# Altium project Hobots-A-Coach-405.PrjPcb
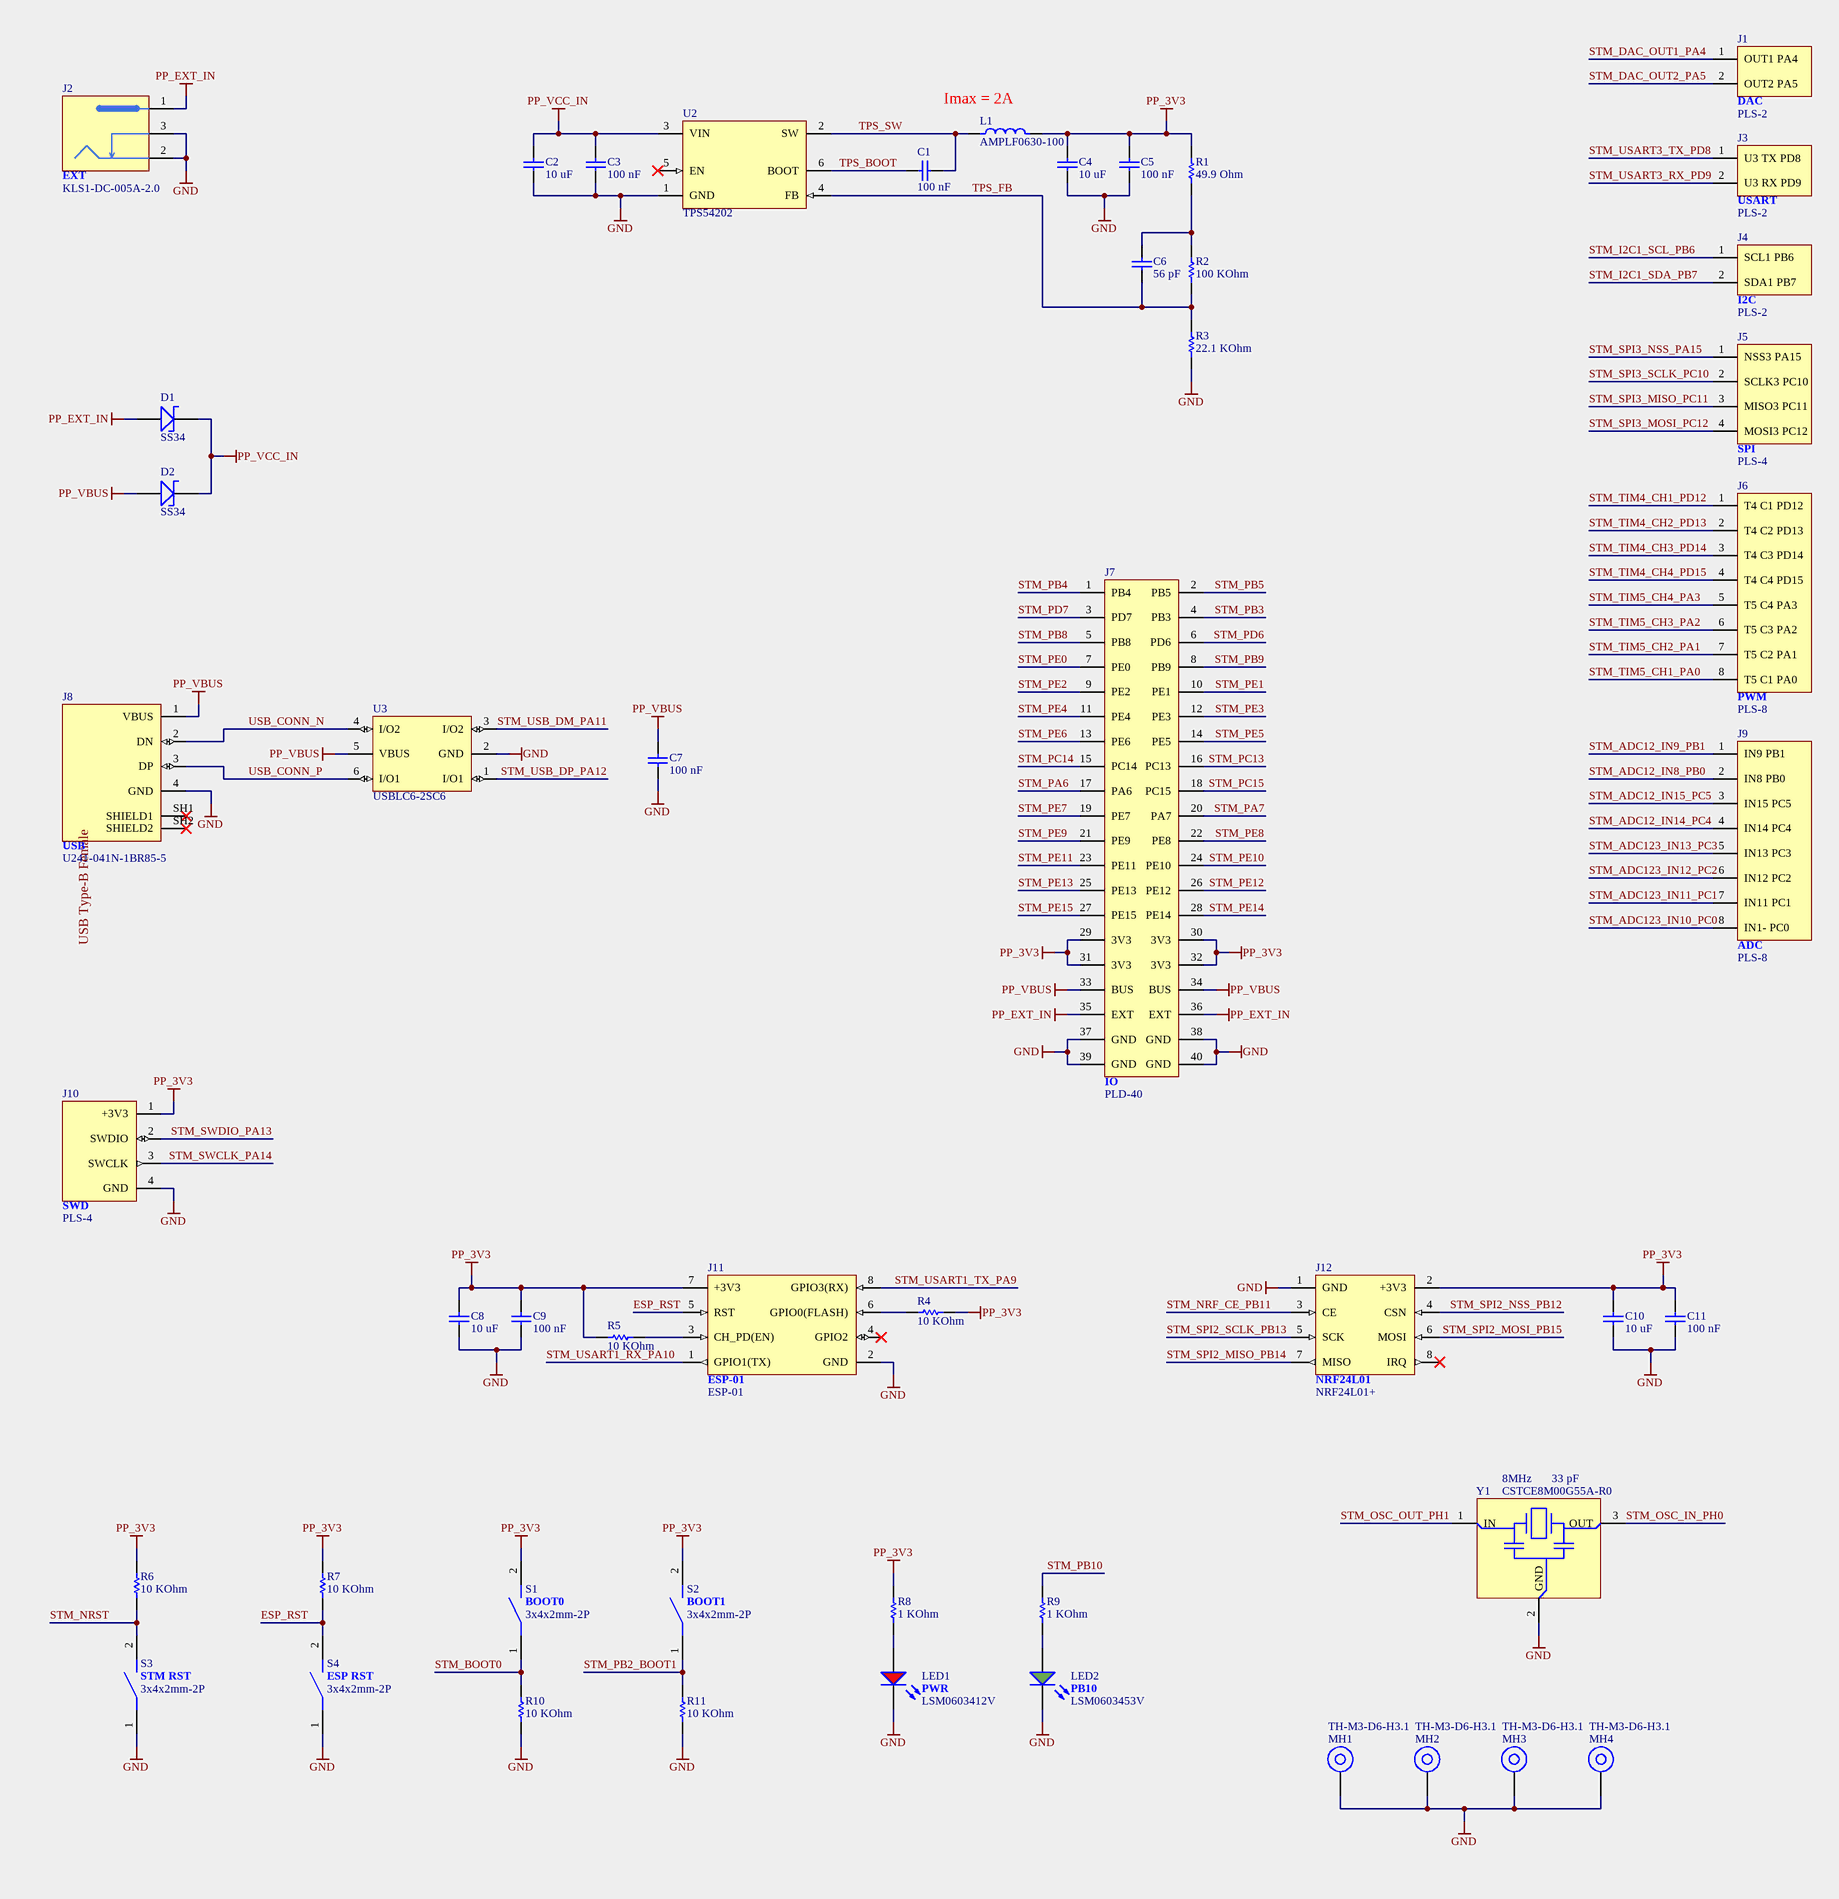
[diagram p0: Hobots-A-Coach-405.SchDoc, left]
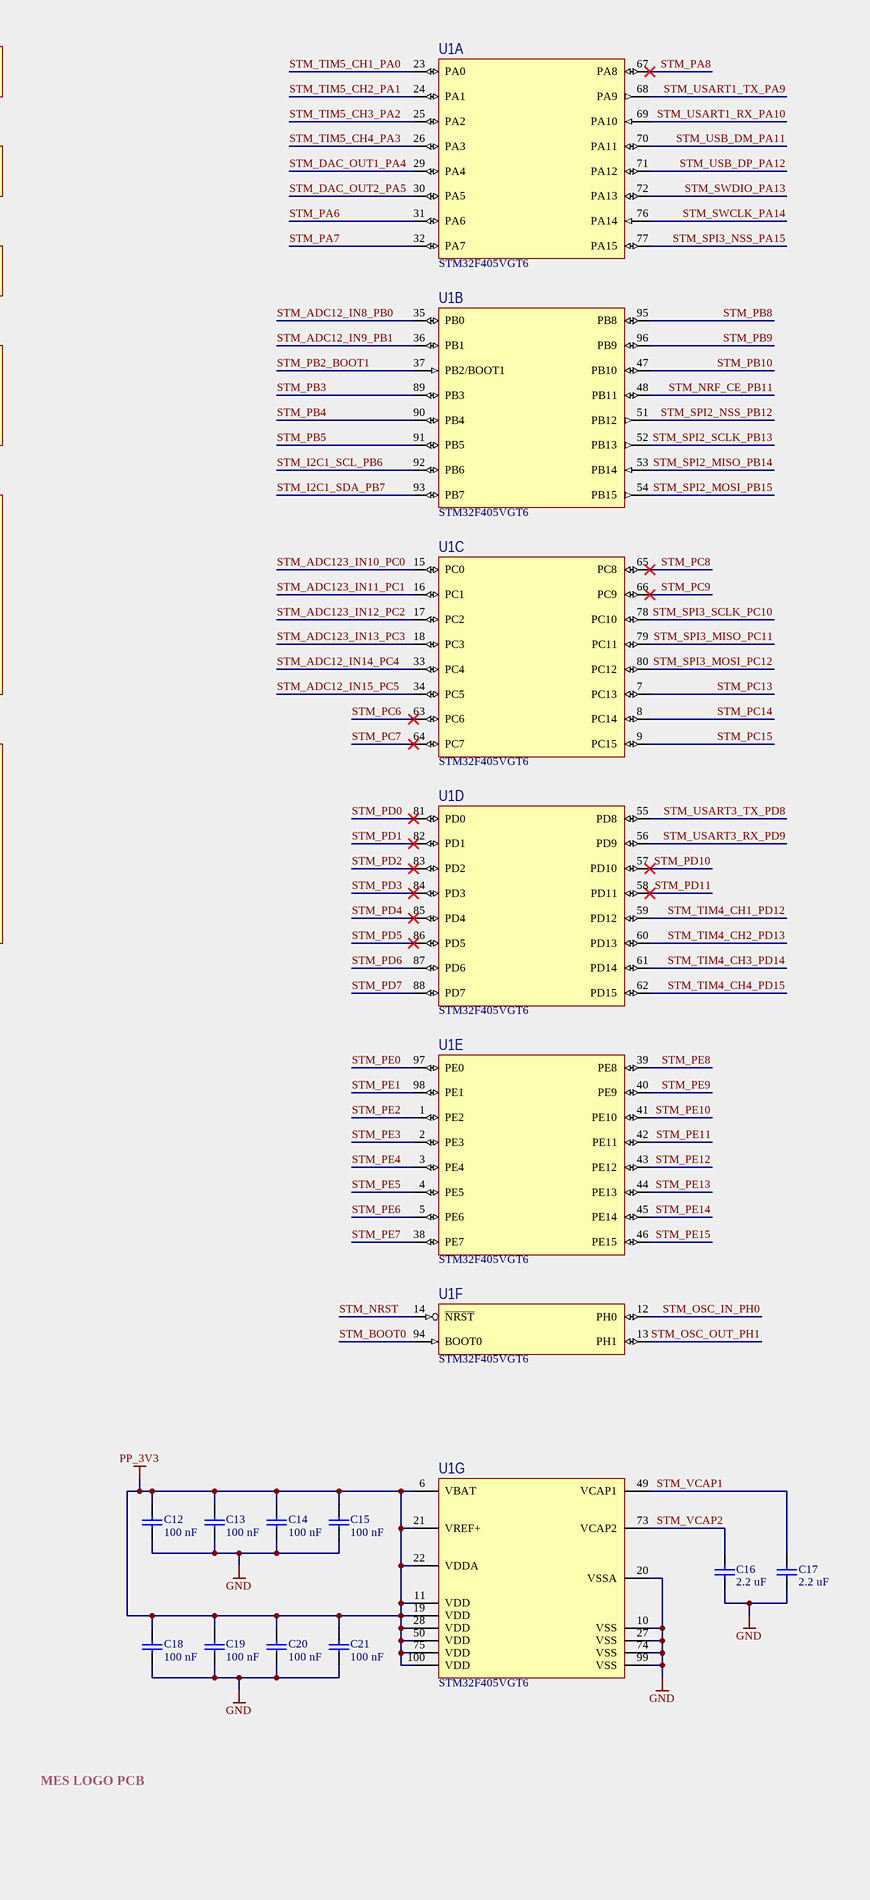
[diagram p1: Hobots-A-Coach-405.SchDoc, right]
1 sheet, 62 parts. Net scope: global (net labels, ports and power ports of the same name join across sheets).
Board file: Hobots-A-Coach-405.PcbDoc

## Sheet Hobots-A-Coach-405.SchDoc: Hobots-A-Coach F405VG
size A2; DrawnBy: School; Organization: MES; Address1: Modern; Address2: Engineering; DocumentNumber: 1; Revision: v1.0; SheetNumber: 1; SheetTotal: 1

### Parts
C1  Capacitance: 100 nF  [CAPC0603]  (hidden comment: CAP-100N)
C2  Capacitance: 10 uF  [CAPC0603]  (hidden comment: CAP-10U)
C3  Capacitance: 100 nF  [CAPC0603]  (hidden comment: CAP-100N)
C4  Capacitance: 10 uF  [CAPC0603]  (hidden comment: CAP-10U)
C5  Capacitance: 100 nF  [CAPC0603]  (hidden comment: CAP-100N)
C6  Capacitance: 56 pF  [CAPC0603]  (hidden comment: CAP-56P)
C7  Capacitance: 100 nF  [CAPC0603]  (hidden comment: CAP-100N)
C8  Capacitance: 10 uF  [CAPC0603]  (hidden comment: CAP-10U)
C9  Capacitance: 100 nF  [CAPC0603]  (hidden comment: CAP-100N)
C10  Capacitance: 10 uF  [CAPC0603]  (hidden comment: CAP-10U)
C11  Capacitance: 100 nF  [CAPC0603]  (hidden comment: CAP-100N)
C12  Capacitance: 100 nF  [CAPC0603]  (hidden comment: CAP-100N)
C13  Capacitance: 100 nF  [CAPC0603]  (hidden comment: CAP-100N)
C14  Capacitance: 100 nF  [CAPC0603]  (hidden comment: CAP-100N)
C15  Capacitance: 100 nF  [CAPC0603]  (hidden comment: CAP-100N)
C16  Capacitance: 2.2 uF  [CAPC0603]  (hidden comment: CAP-2U2)
C17  Capacitance: 2.2 uF  [CAPC0603]  (hidden comment: CAP-2U2)
C18  Capacitance: 100 nF  [CAPC0603]  (hidden comment: CAP-100N)
C19  Capacitance: 100 nF  [CAPC0603]  (hidden comment: CAP-100N)
C20  Capacitance: 100 nF  [CAPC0603]  (hidden comment: CAP-100N)
C21  Capacitance: 100 nF  [CAPC0603]  (hidden comment: CAP-100N)
D1  SS34  [DO-214AC(SMA)]
D2  SS34  [DO-214AC(SMA)]
G1  MES Logo  [MES_LOGO_COPPER_3MM]  (value not drawn)  (no BOM)
J1  DAC  [PLS-2]
J2  EXT  [KLS1-DC-005]
J3  USART  [PLS-2]
J4  I2C  [PLS-2]
J5  SPI  [PLS-4]
J6  PWM  [PLS-8]
J7  IO  [PLD-40]
J8  USB  [U241-041N-1BR85-5]
J9  ADC  [PLS-8]
J10  SWD  [PLS-4]
J11  ESP-01  [ESP-01 Socket]
J12  NRF24L01  PartNumber: NRF24L01+  [NRF24L01+ Socket]
L1  AMPLF0630-100  [AMPLF0630]
LED1  PWR  [LSM0603-Series]
LED2  PB10  [LSM0603-Series]
MH1  TH-M3-D6-H3.1  [TH-M3-D6-H3.1]  (no BOM)
MH2  TH-M3-D6-H3.1  [TH-M3-D6-H3.1]  (no BOM)
MH3  TH-M3-D6-H3.1  [TH-M3-D6-H3.1]  (no BOM)
MH4  TH-M3-D6-H3.1  [TH-M3-D6-H3.1]  (no BOM)
R1  Resistance: 49.9 Ohm  [RES0603]  (hidden comment: RES-49R9)
R2  Resistance: 100 KOhm  [RES0603]  (hidden comment: RES-100K)
R3  Resistance: 22.1 KOhm  [RES0603]  (hidden comment: RES-22K1)
R4  Resistance: 10 KOhm  [RES0603]  (hidden comment: RES-10K)
R5  Resistance: 10 KOhm  [RES0603]  (hidden comment: RES-10K)
R6  Resistance: 10 KOhm  [RES0603]  (hidden comment: RES-10K)
R7  Resistance: 10 KOhm  [RES0603]  (hidden comment: RES-10K)
R8  Resistance: 1 KOhm  [RES0603]  (hidden comment: RES-1K)
R9  Resistance: 1 KOhm  [RES0603]  (hidden comment: RES-1K)
R10  Resistance: 10 KOhm  [RES0603]  (hidden comment: RES-10K)
R11  Resistance: 10 KOhm  [RES0603]  (hidden comment: RES-10K)
S1  BOOT0  Model: 3x4x2mm-2P  [Tactile Switch SMD 3x4x2-2p]
S2  BOOT1  Model: 3x4x2mm-2P  [Tactile Switch SMD 3x4x2-2p]
S3  STM RST  Model: 3x4x2mm-2P  [Tactile Switch SMD 3x4x2-2p]
S4  ESP RST  Model: 3x4x2mm-2P  [Tactile Switch SMD 3x4x2-2p]
U1  STM32F405VGT6  [LQFP-100-STM32]  (parts A,B,C,D,E,F,G of 7)
U2  TPS54202  [SOT23-6-TI-TPS54202]
U3  USBLC6-2SC6  [SOT23-6L-STM]
Y1  LoadCapacitance: 33 pF  Frequency: 8MHz  [MURATA_3213]  (hidden comment: CSTCE8M00G55A-R0)

### Nets
GND: C2.1 C3.1 C4.1 C5.1 C7.1 C8.1 C9.1 C10.1 C11.1 C12.1 C13.1 C14.1 C15.1 C16.1 C17.1 C18.1 C19.1 C20.1 C21.1 J2.2(%) J2.3(%) J7.37(GND) J7.38(GND) J7.39(GND) J7.40(GND) J8.4(GND) J10.4(GND) J11.2(GND) J12.1(GND) LED1.1(K) LED2.1(K) MH1.PTH MH2.PTH MH3.PTH MH4.PTH R3.1 R10.1 R11.1 S3.1 S4.1 U1.10(VSS) U1.20(VSSA) U1.27(VSS) U1.74(VSS) U1.99(VSS) U2.1(GND) U3.2(GND) Y1.2(GND)
PP_3V3: C4.2 C5.2 C8.2 C9.2 C10.2 C11.2 C12.2 C13.2 C14.2 C15.2 C18.2 C19.2 C20.2 C21.2 J7.29(3V3) J7.30(3V3) J7.31(3V3) J7.32(3V3) J10.1(+3V3) J11.7(+3V3) J12.2(+3V3) L1.1 R1.2 R4.1 R5.2 R6.2 R7.2 R8.2 S1.2 S2.2 U1.6(VBAT) U1.11(VDD) U1.19(VDD) U1.21(VREF+) U1.22(VDDA) U1.28(VDD) U1.50(VDD) U1.75(VDD) U1.100(VDD)
PP_EXT_IN: D1.2(A) J2.1(%) J7.35(EXT) J7.36(EXT)
PP_VBUS: C7.2 D2.2(A) J7.33(BUS) J7.34(BUS) J8.1(VBUS) U3.5(VBUS)
PP_VCC_IN: C2.2 C3.2 D1.1(C) D2.1(C) U2.3(VIN)
ESP_RST: J11.5(RST) R7.1 S4.2
STM_ADC12_IN8_PB0: J9.2(IN8_PB0) U1.35(PB0)
STM_ADC12_IN9_PB1: J9.1(IN9_PB1) U1.36(PB1)
STM_ADC12_IN14_PC4: J9.4(IN14_PC4) U1.33(PC4)
STM_ADC12_IN15_PC5: J9.3(IN15_PC5) U1.34(PC5)
STM_ADC123_IN10_PC0: J9.8(IN1-_PC0) U1.15(PC0)
STM_ADC123_IN11_PC1: J9.7(IN11_PC1) U1.16(PC1)
STM_ADC123_IN12_PC2: J9.6(IN12_PC2) U1.17(PC2)
STM_ADC123_IN13_PC3: J9.5(IN13_PC3) U1.18(PC3)
STM_BOOT0: R10.2 S1.1 U1.94(BOOT0)
STM_DAC_OUT1_PA4: J1.1(OUT1_PA4) U1.29(PA4)
STM_DAC_OUT2_PA5: J1.2(OUT2_PA5) U1.30(PA5)
STM_I2C1_SCL_PB6: J4.1(SCL1_PB6) U1.92(PB6)
STM_I2C1_SDA_PB7: J4.2(SDA1_PB7) U1.93(PB7)
STM_NRF_CE_PB11: J12.3(CE) U1.48(PB11)
STM_NRST: R6.1 S3.2 U1.14(~{NRST})
STM_OSC_IN_PH0: U1.12(PH0) Y1.3(OUT)
STM_OSC_OUT_PH1: U1.13(PH1) Y1.1(IN)
STM_PA6: J7.17(PA6) U1.31(PA6)
STM_PA7: J7.20(PA7) U1.32(PA7)
STM_PA8: U1.67(PA8)
STM_PB2_BOOT1: R11.2 S2.1 U1.37(PB2/BOOT1)
STM_PB3: J7.4(PB3) U1.89(PB3)
STM_PB4: J7.1(PB4) U1.90(PB4)
STM_PB5: J7.2(PB5) U1.91(PB5)
STM_PB8: J7.5(PB8) U1.95(PB8)
STM_PB9: J7.8(PB9) U1.96(PB9)
STM_PB10: R9.2 U1.47(PB10)
STM_PC6: U1.63(PC6)
STM_PC7: U1.64(PC7)
STM_PC8: U1.65(PC8)
STM_PC9: U1.66(PC9)
STM_PC13: J7.16(PC13) U1.7(PC13)
STM_PC14: J7.15(PC14) U1.8(PC14)
STM_PC15: J7.18(PC15) U1.9(PC15)
STM_PD0: U1.81(PD0)
STM_PD1: U1.82(PD1)
STM_PD2: U1.83(PD2)
STM_PD3: U1.84(PD3)
STM_PD4: U1.85(PD4)
STM_PD5: U1.86(PD5)
STM_PD6: J7.6(PD6) U1.87(PD6)
STM_PD7: J7.3(PD7) U1.88(PD7)
STM_PD10: U1.57(PD10)
STM_PD11: U1.58(PD11)
STM_PE0: J7.7(PE0) U1.97(PE0)
STM_PE1: J7.10(PE1) U1.98(PE1)
STM_PE2: J7.9(PE2) U1.1(PE2)
STM_PE3: J7.12(PE3) U1.2(PE3)
STM_PE4: J7.11(PE4) U1.3(PE4)
STM_PE5: J7.14(PE5) U1.4(PE5)
STM_PE6: J7.13(PE6) U1.5(PE6)
STM_PE7: J7.19(PE7) U1.38(PE7)
STM_PE8: J7.22(PE8) U1.39(PE8)
STM_PE9: J7.21(PE9) U1.40(PE9)
STM_PE10: J7.24(PE10) U1.41(PE10)
STM_PE11: J7.23(PE11) U1.42(PE11)
STM_PE12: J7.26(PE12) U1.43(PE12)
STM_PE13: J7.25(PE13) U1.44(PE13)
STM_PE14: J7.28(PE14) U1.45(PE14)
STM_PE15: J7.27(PE15) U1.46(PE15)
STM_SPI2_MISO_PB14: J12.7(MISO) U1.53(PB14)
STM_SPI2_MOSI_PB15: J12.6(MOSI) U1.54(PB15)
STM_SPI2_NSS_PB12: J12.4(CSN) U1.51(PB12)
STM_SPI2_SCLK_PB13: J12.5(SCK) U1.52(PB13)
STM_SPI3_MISO_PC11: J5.3(MISO3_PC11) U1.79(PC11)
STM_SPI3_MOSI_PC12: J5.4(MOSI3_PC12) U1.80(PC12)
STM_SPI3_NSS_PA15: J5.1(NSS3_PA15) U1.77(PA15)
STM_SPI3_SCLK_PC10: J5.2(SCLK3_PC10) U1.78(PC10)
STM_SWCLK_PA14: J10.3(SWCLK) U1.76(PA14)
STM_SWDIO_PA13: J10.2(SWDIO) U1.72(PA13)
STM_TIM4_CH1_PD12: J6.1(T4_C1_PD12) U1.59(PD12)
STM_TIM4_CH2_PD13: J6.2(T4_C2_PD13) U1.60(PD13)
STM_TIM4_CH3_PD14: J6.3(T4_C3_PD14) U1.61(PD14)
STM_TIM4_CH4_PD15: J6.4(T4_C4_PD15) U1.62(PD15)
STM_TIM5_CH1_PA0: J6.8(T5_C1_PA0) U1.23(PA0)
STM_TIM5_CH2_PA1: J6.7(T5_C2_PA1) U1.24(PA1)
STM_TIM5_CH3_PA2: J6.6(T5_C3_PA2) U1.25(PA2)
STM_TIM5_CH4_PA3: J6.5(T5_C4_PA3) U1.26(PA3)
STM_USART1_RX_PA10: J11.1(GPIO1(TX)) U1.69(PA10)
STM_USART1_TX_PA9: J11.8(GPIO3(RX)) U1.68(PA9)
STM_USART3_RX_PD9: J3.2(U3_RX_PD9) U1.56(PD9)
STM_USART3_TX_PD8: J3.1(U3_TX_PD8) U1.55(PD8)
STM_USB_DM_PA11: U1.70(PA11) U3.3(I/O2)
STM_USB_DP_PA12: U1.71(PA12) U3.1(I/O1)
STM_VCAP1: C17.2 U1.49(VCAP1)
STM_VCAP2: C16.2 U1.73(VCAP2)
TPS_BOOT: C1.2 U2.6(BOOT)
TPS_FB: C6.1 R2.1 R3.2 U2.4(FB)
TPS_SW: C1.1 L1.2 U2.2(SW)
USB_CONN_N: J8.2(DN) U3.4(I/O2)
USB_CONN_P: J8.3(DP) U3.6(I/O1)
NetC6_2: C6.2 R1.1 R2.2
NetJ11_3: J11.3(CH_PD(EN)) R5.1
NetJ11_6: J11.6(GPIO0(FLASH)) R4.2
NetLED1_2: LED1.2(A) R8.1
NetLED2_2: LED2.2(A) R9.1

Not connected (* = marked no-connect by the designer): J8 SH1(SHIELD1)* SH2(SHIELD2)*; J11 4(GPIO2)*; J12 8(IRQ)*; U2 5(EN)*

### Notes on the sheet
- (near L1) Imax = 2A
- Title
- Size:
- Date:
- File:
- A2
- Number:
- Time:
- Revision:
- Sheet
- of
- (in symbol MES Logo) MES LOGO PCB
- (in symbol USB-B U241-041N-1BR85-5) USB Type-B Female

### Library data of the parts
C1 C3 C5 C7 C9 C11-C15 C18-C21 = CAP-100N: Chip Capacitor, 100 nF, +/- 5%; Voltage Rating: 50 V; Mount: Surface Mount; Tolerance: 5 %; Type: Capacitor
C2 C4 C8 C10 = CAP-10U: Chip Capacitor, 10 uF, +/- 5%; Voltage Rating: 50 V; Mount: Surface Mount; Tolerance: 5 %; Type: Capacitor
C6 = CAP-56P: Chip Capacitor, 56 pF, +/- 5%; Voltage Rating: 50 V; Mount: Surface Mount; Tolerance: 5 %; Type: Capacitor
C16 C17 = CAP-2U2: Chip Capacitor, 2.2 uF, +/- 5; Voltage Rating: 50 V; Tolerance: 5 %; Mount: Surface Mount; Type: Capacitor
D1 D2 = SS34: 40V 3A Low forward voltage drop. High current capability Schottky Diode.; Type: Schottky Diode; Mount: Surface Mount; PartNumber: SS34
G1 = MES Logo: Logotips MES GROUP
J1 J3 J4 = PLS-2: pitch 2.54; Type: Connector; Mount: Through Hole; PartNumber: PLS-2
J2 = KLS1-DC-005A-2.0: 5.5mm 2.0mm 2A 16V; Type: Connector; Mount: Through Hole; PartNumber: KLS1-DC-005A-2.0
J5 = PLS-4: pitch 2.54; Type: Connector; Mount: Through Hole; PartNumber: PLS-4
J6 J9 = PLS-8: pitch 2.54; Type: Connector; Mount: Through Hole; PartNumber: PLS-8
J7 = PLD-40: 2 row, pitch 2.54; Type: Connector; Mount: Through Hole; PartNumber: PLD-40
J8 = USB-B U241-041N-1BR85-5: USB - Type B Female USB 2 4 Through Hole USB Connectors; Type: Connector; Mount: Through Hole; PartNumber: U241-041N-1BR85-5
J10 = SWD-PLS4: STM SWD 4 pin; Type: Connector; Mount: Through Hole; PartNumber: PLS-4
J11 = ESP-01 Socket: Socket for ESP8266 ESP-01 Connector PBD 8 pins 2x4 pitch 2.54; Type: Connector; Mount: Through Hole; PartNumber: ESP-01
J12 = NRF24L01+ Socket: Socket for NRF24L01 / NRF24L01+ Connector PBD 8 pins 2x4 pitch 2.54; Type: Connector; Mount: Through Hole
L1 = AMPLF0630-100: Shielded Power Inductor 10μH ± 20%; DC Current: 3.6A; Type: Inductor; Mount: Surface Mount; PartNumber: AMPLF0630-100
LED1 = LSM0603412V: Red LED 0603 2V 20mA; Mount: Surface Mount; Type: LED; Color: Red; PartNumber: LSM0603412V
LED2 = LSM0603453V: Green LED 0603 3V 20mA; Mount: Surface Mount; Type: LED; Color: Green; PartNumber: LSM0603453V
R1 = RES-49R9: Chip Resistor, 49.9 Ohm, +/- 1%; Voltage Rating: 50 V; Mount: Surface Mount; Tolerance: 1 %; Type: Resistor
R2 = RES-100K: Chip Resistor, 100 KOhm, +/- 1%; Voltage Rating: 50 V; Mount: Surface Mount; Tolerance: 1 %; Type: Resistor
R3 = RES-22K1: Chip Resistor, 22.1 KOhm, +/- 1%; Voltage Rating: 50 V; Mount: Surface Mount; Tolerance: 1 %; Type: Resistor
R4-R7 R10 R11 = RES-10K: Chip Resistor, 10 KOhm, +/- 1%; Voltage Rating: 50 V; Mount: Surface Mount; Tolerance: 1 %; Type: Resistor
R8 R9 = RES-1K: Chip Resistor, 1 KOhm, +/- 1%; Voltage Rating: 50 V; Mount: Surface Mount; Tolerance: 1 %; Type: Resistor
S1-S4 = Tactile Switch 2P 3x4x2: 2-Pin SMD Tactile Switch, sunrom 3x4x2mm 12V DC 0.2A; Type: Tactile Switch; Mount: Surface Mount
U1 = STM32F405VGT6: 1024 KB Flash 192 RAM 168 MHz ARM based 32-bit MCU; Digit: 32 bit; Type: Microcontroller; Mount: Surface Mount; PartNumber: STM32F405VGT6
U2 = TPS54202: 4.5-V to 28-V Input, 2-A Output, EMI Friendly / Synchronous Step Down Converter; Type: Step-Down DC-DC; Mount: Surface Mount; Package: SOT23-6; PartNumber: TPS54202
U3 = USBLC6-2SC6: Very low capacitance ESD protection  3.5 pF max. USB 2.0 ports up to 480 Mb/s. Ethernet port: 10/100 Mb/s.  SIM card protection; ESD: 25 kV; Mount: Surface Mount; Type: TVS Diode; PartNumber: USBLC6-2SC6
Y1 = CSTCE8M00G55A-R0: 8MHz ±0.5% 33pF 40 Ohm(Max) SMDCrystal Resonators; Type: Quartz Crystal Resonator; Mount: Surface Mount; PartNumber: CSTCE8M00G55A-R0